# Altium schematic sheet LT8315.SchDoc: LTC8315
size A4; Author: Gurubaani; Organization: Waterloop; Address1: 200 University Ave W; Address2: Engineering 5, 1104; Address3: Waterloo, ON; Address4: N2L 3G1; Revision: C; SheetNumber: 3; SheetTotal: 4
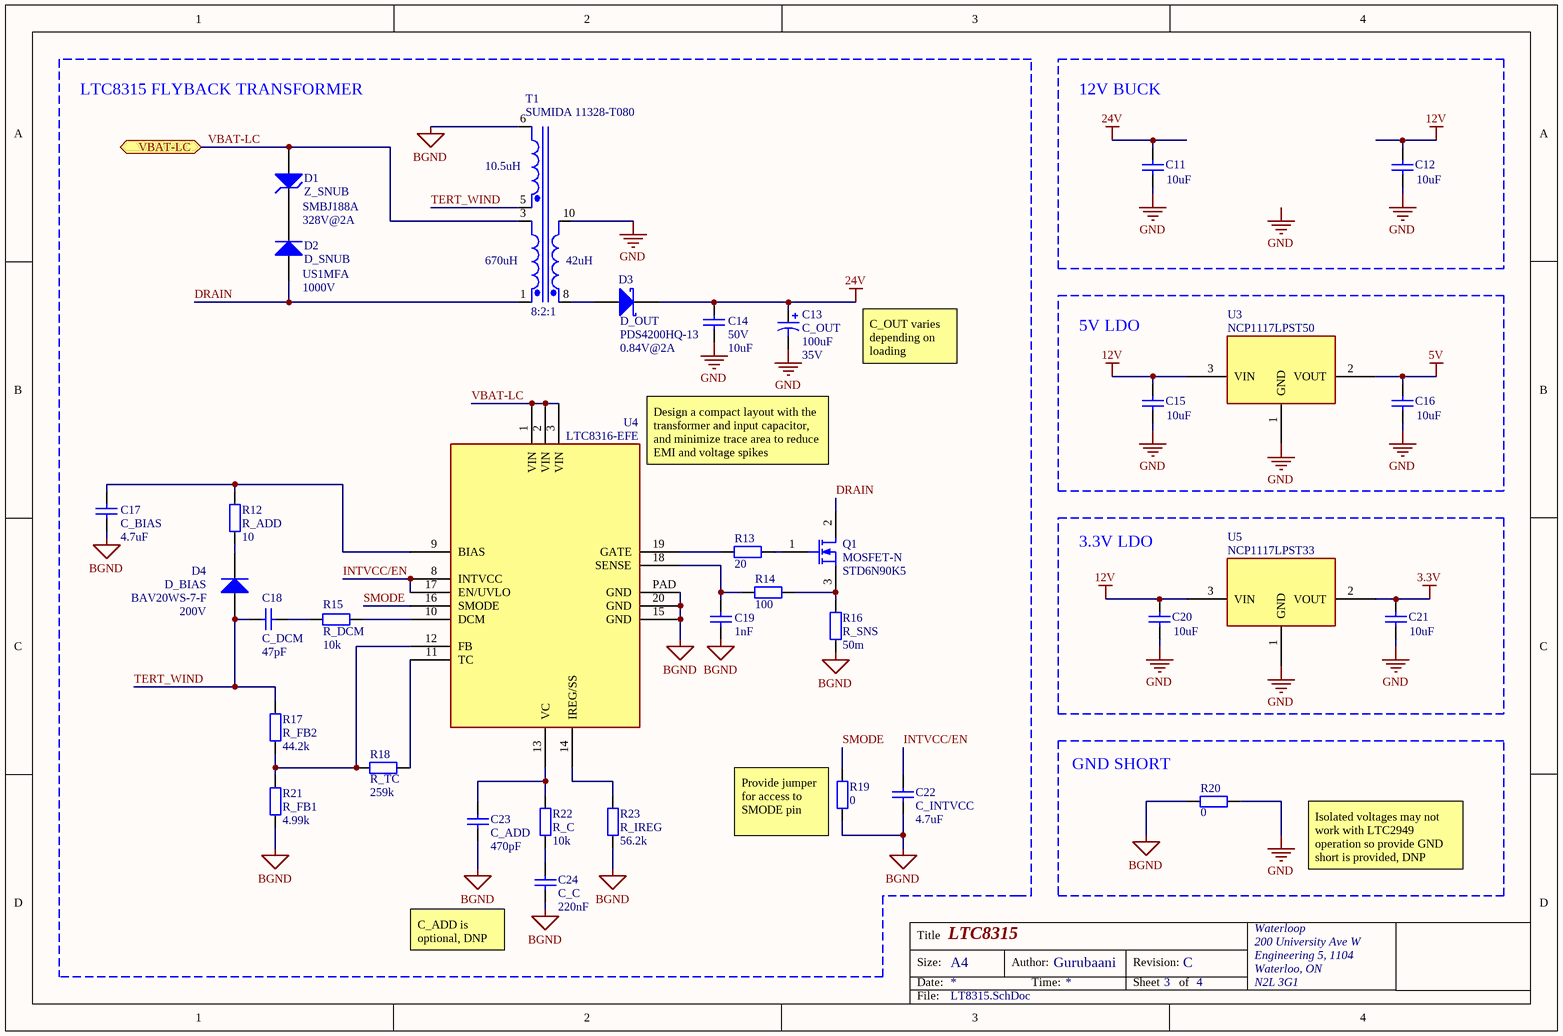
[diagram p0: LT8315.SchDoc]

## Parts
C11  value 10uF  [C0805]  (hidden comment: C_OUT)
C12  value 10uF  [C0805]  (hidden comment: C_OUT)
C13  C_OUT  value 100uF  Voltage: 35V  [RB7.6-15]
C14  value 10uF  Voltage: 50V  [C0805]  (hidden comment: C_OUT)
C15  value 10uF  [C0805]  (hidden comment: C_OUT)
C16  value 10uF  [C0805]  (hidden comment: C_OUT)
C17  C_BIAS  value 4.7uF  [C0805]
C18  C_DCM  value 47pF  [C0805]
C19  value 1nF  [C0805]  (hidden comment: C_OUT)
C20  value 10uF  [C0805]  (hidden comment: C_OUT)
C21  value 10uF  [C0805]  (hidden comment: C_OUT)
C22  C_INTVCC  value 4.7uF  [C0805]
C23  C_ADD  value 470pF  [C0805]
C24  C_C  value 220nF  [C0805]
D1  Z_SNUB  Reverse Voltage: 328V@2A  PartNumber: SMBJ188A  [DO-214AA, SMB]
D2  D_SNUB  Reverse Voltage: 1000V  PartNumber: US1MFA  [SOD-123FL]
D3  D_OUT  Forward Voltage: 0.84V@2A  PartNumber: PDS4200HQ-13  [POWERDI5 (DPAK184P650X115-3N)]
D4  D_BIAS  Reverse Voltage: 200V  PartNumber: BAV20WS-7-F  [SOD323]
Q1  MOSFET-N  Part Number: STD6N90K5  [DPAK (228P972X240-3N)]
R12  R_ADD  value 10  [J1-0603]
R13  value 20  [J1-0603]  (hidden comment: R_SNS)
R14  value 100  [J1-0603]  (hidden comment: R_SNS)
R15  R_DCM  value 10k  [J1-0603]
R16  R_SNS  value 50m  [J1-0603]
R17  R_FB2  value 44.2k  [J1-0603]
R18  R_TC  value 259k  [J1-0603]
R19  value 0  [J1-0603]  (hidden comment: R_C)
R20  value 0  [J1-0603]  (hidden comment: R_C)
R21  R_FB1  value 4.99k  [J1-0603]
R22  R_C  value 10k  [J1-0603]
R23  R_IREG  value 56.2k  [J1-0603]
T1  8:2:1  Part Number: SUMIDA 11328-T080  Primary Inductance: 670uH  Secondary Inductance: 42uH  Tertiary Inducatance: 10.5uH  [PQ2620]
U3  NCP1117LPST50  [NCP1117LPST]
U4  LTC8316-EFE  [LTC8315/8316]
U5  NCP1117LPST33  [NCP1117LPST]

## Blocks framed on the sheet
LTC8315 FLYBACK TRANSFORMER: C13 C14 C17-C19 C22-C24 D1-D4 Q1 R12-R19 R21-R23 T1 U4
12V BUCK: C11 C12
5V LDO: C15 C16 U3
3.3V LDO: C20 C21 U5
GND SHORT: R20

## Ports
VBAT-LC (bidir)

## Nets
3.3V: C21.2 U5.2(VOUT)
5V: C16.2 U3.2(VOUT)
12V: C12.2 C15.2 C20.2 U3.3(VIN) U5.3(VIN)
24V: C11.2 C13.1 C14.2 D3.2(K)
BGND: C17.1 C19.1 C22.2 C23.1 C24.1 R16.2 R19.1 R20.2 R21.1 R23.1 T1.6(Sec2-) U4.15(GND) U4.20(GND) U4.PAD(GND)
GND: C11.1 C12.1 C13.2 C14.1 C15.1 C16.1 C20.1 C21.1 R20.1 T1.10(Pri-) U3.1(GND) U5.1(GND)
DRAIN: D2.1(A) Q1.2(D) T1.1(Sec1+)
INTVCC/EN: C22.1 U4.8(INTVCC) U4.17(EN/UVLO)
SMODE: R19.2 U4.16(SMODE)
TERT_WIND: C18.1 D4.1(A) R17.2 T1.5(Sec2+)
VBAT-LC: D1.1(A) T1.3(Sec1-) U4.1(VIN) U4.2(VIN) U4.3(VIN) ; port VBAT-LC
NetC17_2: C17.2 R12.1 U4.9(BIAS)
NetC18_2: C18.2 R15.2
NetC19_2: C19.2 R14.1 U4.18(SENSE)
NetC23_2: C23.2 R22.2 U4.13(VC)
NetC24_2: C24.2 R22.1
NetD1_2: D1.2(K) D2.2(K)
NetD3_1: D3.1(A) T1.8(Pri+)
NetD4_2: D4.2(K) R12.2
NetQ1_1: Q1.1(G) R13.2
NetQ1_3: Q1.3(S) R14.2 R16.1
NetR13_1: R13.1 U4.19(GATE)
NetR15_1: R15.1 U4.10(DCM)
NetR17_1: R17.1 R18.2 R21.2 U4.12(FB)
NetR18_1: R18.1 U4.11(TC)
NetR23_2: R23.2 U4.14(IREG/SS)

## Notes on the sheet
- C_OUT varies depending on loading
- (near U4) Design a compact layout with the transformer and input capacitor, and minimize trace area to reduce EMI and voltage spikes
- (near R19) Provide jumper for access to SMODE pin
- Isolated voltages may not work with LTC2949 operation so provide GND short is provided, DNP
- (near C24) C_ADD is optional, DNP
- Labels drawn without touching a wire or pin: GND
- Title
- Size:
- Date:
- A4
- Author:
- Time:
- Revision:
- Sheet
- of
- File:

## Library data of the parts
C11 C12 C14-C24 = Cap: Capacitor; Published: 8-Jun-2000; LatestRevisionDate: 17-Jul-2002; LatestRevisionNote: Re-released for DXP Platform.; PackageReference: RAD-0.3; Publisher: Altium Limited; PackageDescription: Radial Cap, Thru-Hole; 2 Leads; 0.3 in Pin Spacing
C13 = Cap Pol1: Polarized Capacitor (Radial); Published: 8-Jun-2000; LatestRevisionDate: 17-Jul-2002; LatestRevisionNote: Re-released for DXP Platform.; PackageReference: RB7.6-15; Publisher: Altium Limited; PackageDescription: Polarized Capacitor (Radial); 2 Leads
D1 = D Zener: Zener Diode
D2 D4 = Diode: Default Diode
D3 = D Schottky: Schottky Diode
Q1 = MOSFET-N: N-Channel MOSFET; Published: 8-Jun-2000; LatestRevisionDate: 17-Jul-2002; LatestRevisionNote: Re-released for DXP Platform.; PackageVersion: 1995/1996; PackageReference: E3; Publisher: Altium Limited; PackageDescription: TO, Flat Index; 3 In-Line, Axial Leads; Body Dia. 4.6mm; Lead Dia. 0.5 mm (max)
R12-R23 = Res2: Resistor; Published: 8-Jun-2000; LatestRevisionDate: 17-Jul-2002; LatestRevisionNote: Re-released for DXP Platform.; PackageReference: AXIAL-0.4; Publisher: Altium Limited; PackageDescription: Axial Device, Thru-Hole; 2 Leads; 0.4 in Pin Spacing
T1 = Trans3: Three-winding Transformer (Non-Ideal); Published: 25-Jan-2001; LatestRevisionDate: 17-Jul-2002; LatestRevisionNote: Re-released for DXP Platform.
U3 = NCP1117LPST50: IC REG LINEAR 5V 1A SOT223
U4 = LTC8316-EFE: 600VIN MICROPOWER, ISOLATED NO-O
U5 = NCP1117LPST33: IC REG LINEAR 3.3V 1A SOT223